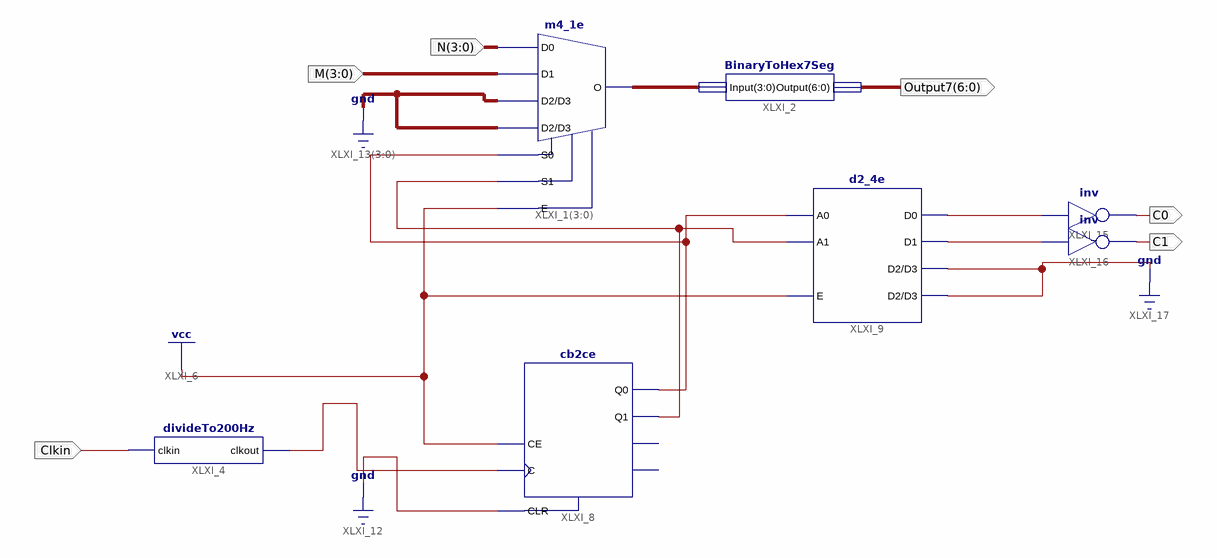
[diagram p0: schematic sheet 1]
// Xilinx ISE schematic Selector.sch (spartan6) as structural Verilog: 7 symbols, 6 ports
module Selector (
  input  [3:0] N,
  input  Clkin,
  input  [3:0] M,
  output [6:0] Output7,
  output C0,
  output C1
);

  wire Q0, Q1, XLXN_29, XLXN_36, XLXN_37;
  wire [3:0] Output;

  m4_1e XLXI_1[3:0] (.D0(N), .D1(M), .D2(4'b0000), .D3(4'b0000), .E(1'b1), .S0(Q0), .S1(Q1), .O(Output));
  BinaryToHex7Seg XLXI_2 (.Input(Output), .Output(Output7));
  divideTo200Hz XLXI_4 (.clkin(Clkin), .clkout(XLXN_29));
  cb2ce XLXI_8 (.C(XLXN_29), .CE(1'b1), .CLR(1'b0), .Q0(Q0), .Q1(Q1));  // open: CEO, TC
  d2_4e XLXI_9 (.A0(Q0), .A1(Q1), .E(1'b1), .D0(XLXN_36), .D1(XLXN_37), .D2(1'b0), .D3(1'b0));
  not XLXI_15 (C0, XLXN_36);
  not XLXI_16 (C1, XLXN_37);
endmodule
